# Altium schematic sheet Atmega secondary.SchDoc
size A
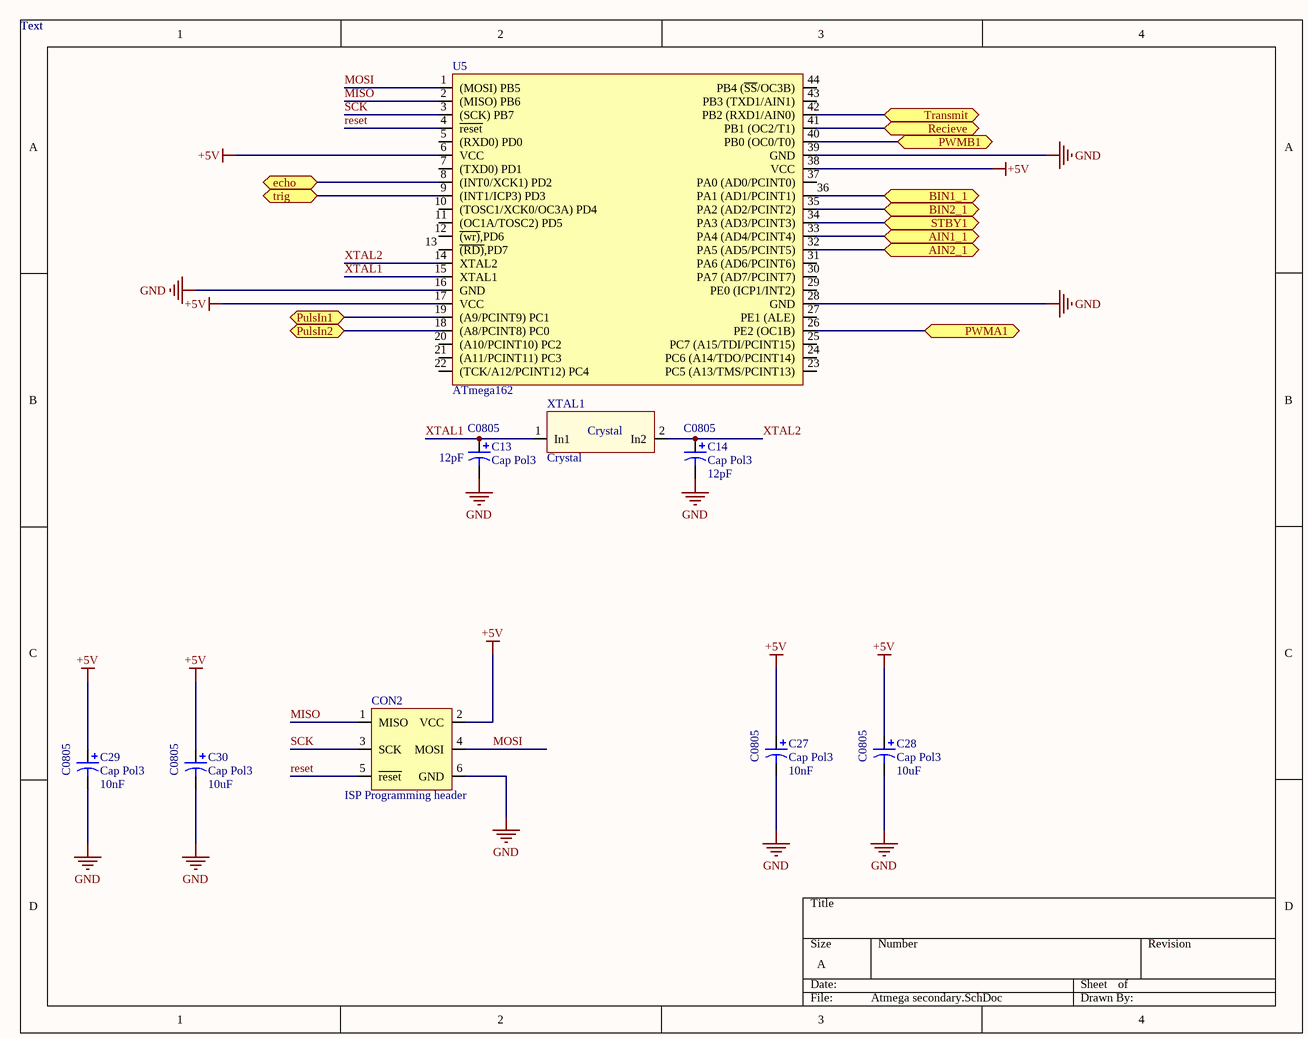
[diagram p0: Atmega secondary.SchDoc]

## Parts
C13  Cap Pol3  value 12pF  [C0805]
C14  Cap Pol3  value 12pF  [C0805]
C27  Cap Pol3  value 10nF  [C0805]
C28  Cap Pol3  value 10uF  [C0805]
C29  Cap Pol3  value 10nF  [C0805]
C30  Cap Pol3  value 10uF  [C0805]
CON2  ISP Programming header  [ISP programming header]
U5  ATmega162  [ATmga162]
XTAL1  Crystal  [Crystal]

## Ports
AIN1_1, AIN2_1, BIN1_1, BIN2_1, echo, PulsIn1, PulsIn2, PWMA1, PWMB1, Recieve, STBY1, Transmit, trig

## Nets
+5V: C27.1 C28.1 C29.1 C30.1 CON2.2(VCC) U5.6(VCC) U5.17(VCC) U5.38(VCC)
GND: C13.2 C14.2 C27.2 C28.2 C29.2 C30.2 CON2.6(GND) U5.16(GND) U5.28(GND) U5.39(GND)
AIN1_1: U5.33(PA4_(AD4/PCINT4)) ; port AIN1_1
AIN2_1: U5.32(PA5_(AD5/PCINT5)) ; port AIN2_1
BIN1_1: U5.36(PA1_(AD1/PCINT1)) ; port BIN1_1
BIN2_1: U5.35(PA2_(AD2/PCINT2)) ; port BIN2_1
echo: U5.8((INT0/XCK1)_PD2) ; port echo
MISO: CON2.1(MISO) U5.2((MISO)_PB6)
MOSI: CON2.4(MOSI) U5.1((MOSI)_PB5)
PulsIn1: U5.19((A9/PCINT9)_PC1) ; port PulsIn1
PulsIn2: U5.18((A8/PCINT8)_PC0) ; port PulsIn2
PWMA1: U5.26(PE2_(OC1B)) ; port PWMA1
PWMB1: U5.40(PB0_(OC0/T0)) ; port PWMB1
Recieve: U5.41(PB1_(OC2/T1)) ; port Recieve
reset: CON2.5(~{reset}) U5.4(~{reset})
SCK: CON2.3(SCK) U5.3((SCK)_PB7)
STBY1: U5.34(PA3_(AD3/PCINT3)) ; port STBY1
Transmit: U5.42(PB2_(RXD1/AIN0)) ; port Transmit
trig: U5.9((INT1/ICP3)_PD3) ; port trig
XTAL1: C13.1 U5.15(XTAL1) XTAL1.1(In1)
XTAL2: C14.1 U5.14(XTAL2) XTAL1.2(In2)

Not connected (* = marked no-connect by the designer): U5 5((RXD0)_PD0) 7((TXD0)_PD1) 10((TOSC1/XCK0/OC3A)_PD4) 11((OC1A/TOSC2)_PD5) 12(~{(wr}~{)},PD6) 13(~{(RD)},PD7) 20((A10/PCINT10)_PC2) 21((A11/PCINT11)_PC3) 22((TCK/A12/PCINT12)_PC4) 23(PC5_(A13/TMS/PCINT13)) 24(PC6_(A14/TDO/PCINT14)) 25(PC7_(A15/TDI/PCINT15)) 27(PE1_(ALE)) 29(PE0_(ICP1/INT2)) 30(PA7_(AD7/PCINT7)) 31(PA6_(AD6/PCINT6)) 37(PA0_(AD0/PCINT0)) 43(PB3_(TXD1/AIN1)) 44(PB4_(~{SS}/OC3B))

## Notes on the sheet
- Text

## Library data of the parts
C13 C14 C27-C30 = Cap Pol3: Polarized Capacitor (Surface Mount); Published: 8-Jun-2000; LatestRevisionDate: 29-May-2009; LatestRevisionNote: IPC-7351 Footprint Added.; PackageReference: C0805; Publisher: Altium Limited; PackageDescription: Chip Capacitor